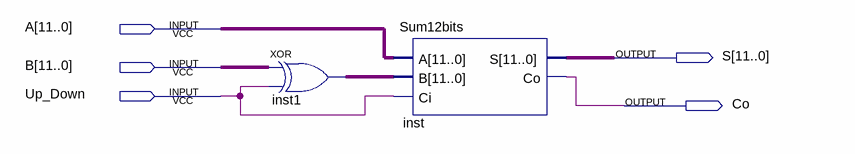
[diagram p0: schematic sheet]
// Quartus schematic Sum_Res.bdf as structural Verilog: 2 symbols, 5 pins
module Sum_Res (
  input  [11:0] A,
  input  [11:0] B,
  input  Up_Down,
  output [11:0] S,
  output Co
);

  wire [11:0] inst1_out;

  assign inst1_out = B ^ {12{Up_Down}};  // XOR inst1, 12 bits wide
  Sum12bits inst (.A(A), .B(inst1_out), .Ci(Up_Down), .S(S), .Co(Co));
endmodule
